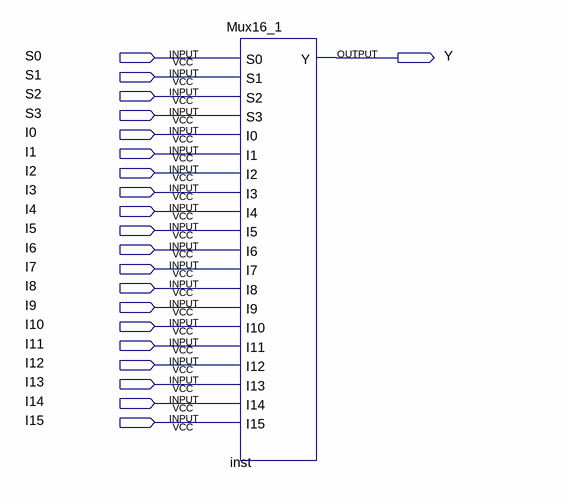
[diagram p0: schematic sheet]
// Quartus schematic MuxDemo2.bdf as structural Verilog: 1 symbols, 21 pins
module MuxDemo2 (
  input  S0,
  input  S1,
  input  S2,
  input  S3,
  input  I0,
  input  I1,
  input  I2,
  input  I3,
  input  I4,
  input  I5,
  input  I6,
  input  I7,
  input  I8,
  input  I9,
  input  I10,
  input  I11,
  input  I12,
  input  I13,
  input  I14,
  input  I15,
  output Y
);

  Mux16_1 inst (
    .S0(S0), .S1(S1), .S2(S2), .S3(S3), .I0(I0), .I1(I1), .I2(I2), .I3(I3), .I4(I4), .I5(I5), .I6(I6),
    .I7(I7), .I8(I8), .I9(I9), .I10(I10), .I11(I11), .I12(I12), .I13(I13), .I14(I14), .I15(I15), .Y(Y));
endmodule
